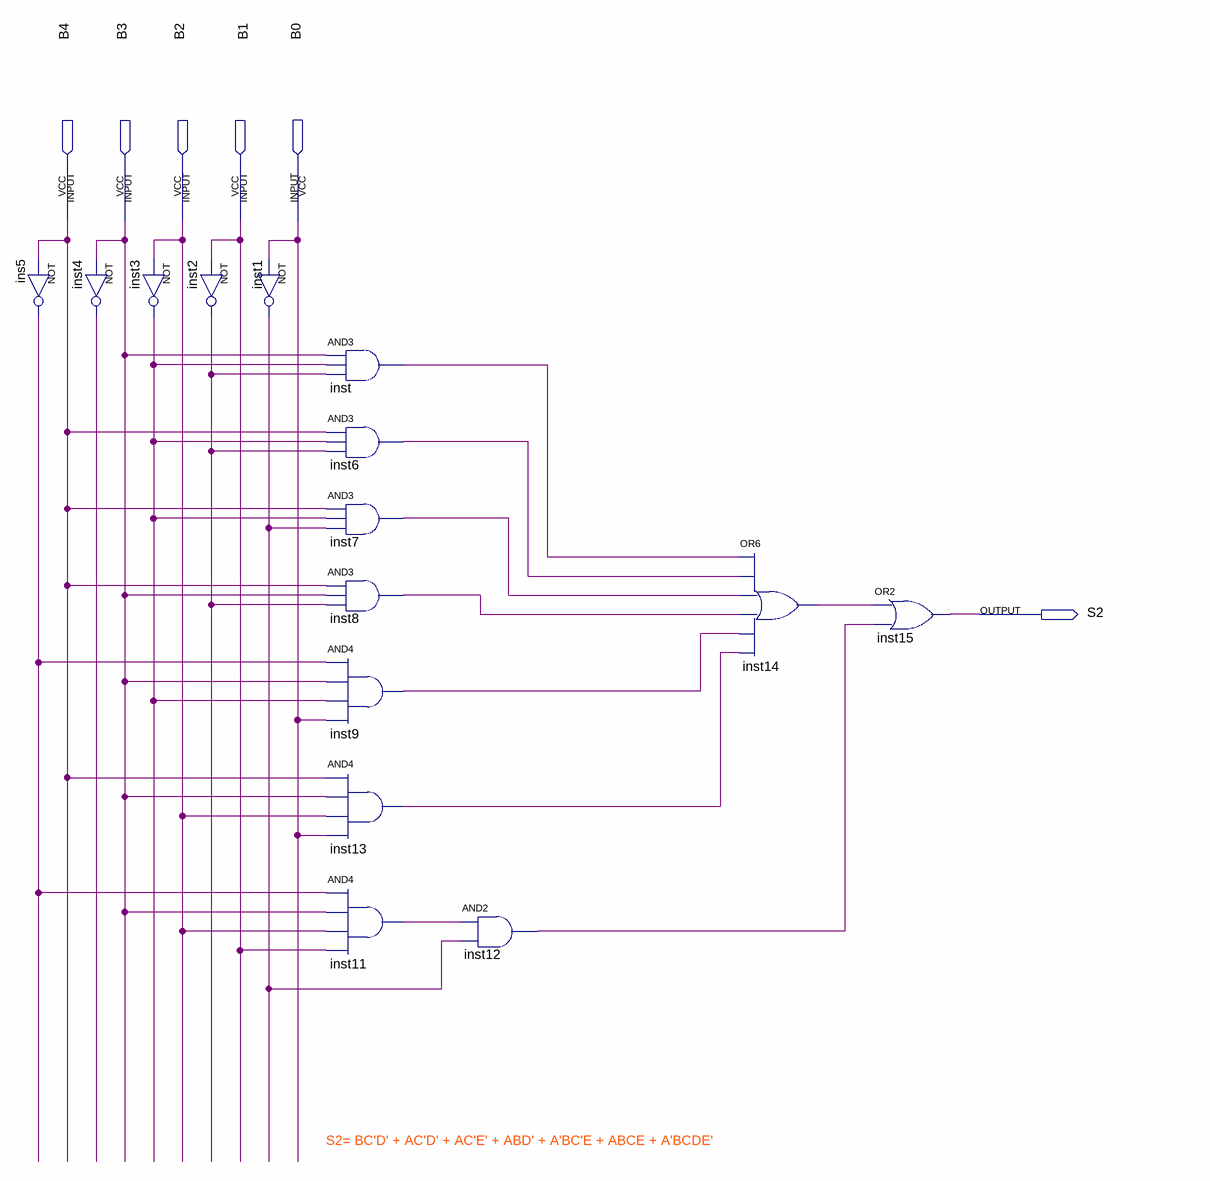
[diagram p0: schematic sheet]
// Quartus schematic Andares_Elevador_S2.bdf as structural Verilog: 15 symbols, 6 pins
module Andares_Elevador_S2 (
  input  B4,
  input  B3,
  input  B2,
  input  B1,
  input  B0,
  output S2
);

  wire ins5_out, inst1_out, inst2_out, inst3_out, inst4_out, inst6_out, inst7_out, inst8_out, inst9_out,
       inst11_out, inst12_out, inst13_out, inst14_out, inst_out;

  not inst4 (inst4_out, B3);
  not ins5 (ins5_out, B4);
  not inst3 (inst3_out, B2);
  not inst2 (inst2_out, B1);
  not inst1 (inst1_out, B0);
  and inst (inst_out, B3, inst3_out, inst2_out);
  and inst6 (inst6_out, B4, inst3_out, inst2_out);
  and inst7 (inst7_out, B4, inst3_out, inst1_out);
  and inst8 (inst8_out, B4, B3, inst2_out);
  and inst9 (inst9_out, ins5_out, B3, inst3_out, B0);
  and inst13 (inst13_out, B4, B3, B2, B0);
  and inst11 (inst11_out, ins5_out, B3, B2, B1);
  and inst12 (inst12_out, inst11_out, inst1_out);
  or inst14 (inst14_out, inst_out, inst6_out, inst7_out, inst8_out, inst9_out, inst13_out);
  or inst15 (S2, inst14_out, inst12_out);

  // Notes on the sheet:
  //   S2= BC'D' + AC'D' + AC'E' + ABD' + A'BC'E + ABCE + A'BCDE'
endmodule
